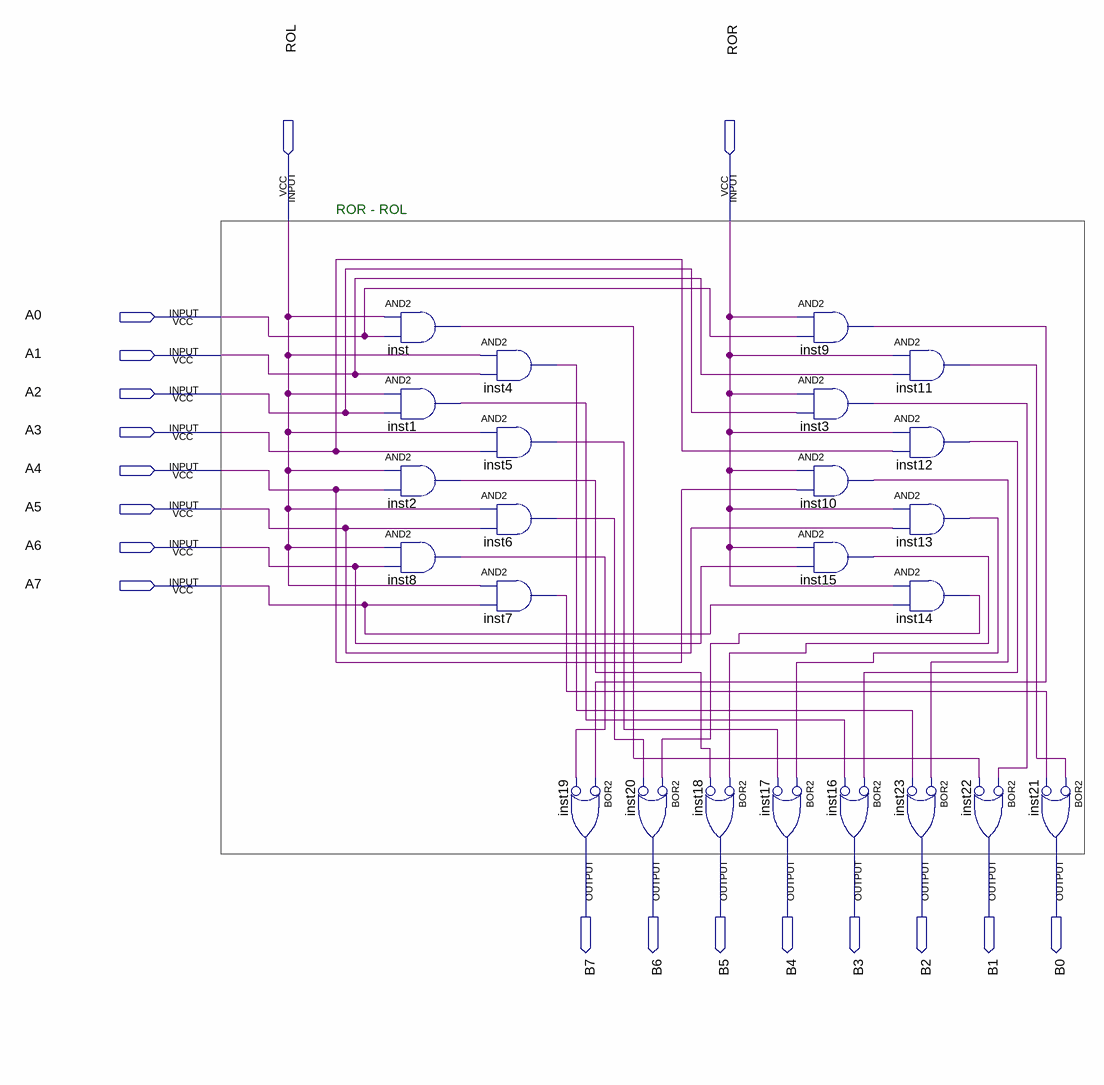
[diagram p0: schematic sheet]
// Quartus schematic 8bitrot.bdf as structural Verilog: 24 symbols, 18 pins
module \8bitrot  (
  input  ROL,
  input  ROR,
  input  A0,
  input  A1,
  input  A2,
  input  A3,
  input  A4,
  input  A5,
  input  A6,
  input  A7,
  output B7,
  output B6,
  output B5,
  output B4,
  output B3,
  output B2,
  output B1,
  output B0
);

  wire inst1_out, inst2_out, inst3_out, inst4_out, inst5_out, inst6_out, inst7_out, inst8_out, inst9_out,
       inst10_out, inst11_out, inst12_out, inst13_out, inst14_out, inst15_out, inst_out;

  and inst (inst_out, ROL, A0);
  and inst1 (inst1_out, ROL, A2);
  and inst2 (inst2_out, ROL, A4);
  and inst8 (inst8_out, ROL, A6);
  and inst4 (inst4_out, ROL, A1);
  and inst5 (inst5_out, ROL, A3);
  and inst6 (inst6_out, ROL, A5);
  and inst7 (inst7_out, ROL, A7);
  or inst19 (B7, ~inst9_out, ~inst8_out);  // BOR2
  or inst20 (B6, ~inst14_out, ~inst6_out);  // BOR2
  or inst17 (B4, ~inst13_out, ~inst5_out);  // BOR2
  or inst18 (B5, ~inst15_out, ~inst2_out);  // BOR2
  and inst9 (inst9_out, ROR, A0);
  and inst3 (inst3_out, ROR, A2);
  and inst10 (inst10_out, ROR, A4);
  and inst15 (inst15_out, ROR, A6);
  or inst16 (B3, ~inst12_out, ~inst1_out);  // BOR2
  and inst11 (inst11_out, ROR, A1);
  and inst12 (inst12_out, ROR, A3);
  and inst13 (inst13_out, ROR, A5);
  and inst14 (inst14_out, ROR, A7);
  or inst23 (B2, ~inst10_out, ~inst4_out);  // BOR2
  or inst22 (B1, ~inst3_out, ~inst_out);  // BOR2
  or inst21 (B0, ~inst11_out, ~inst7_out);  // BOR2

  // Notes on the sheet:
  //   ROR - ROL
endmodule
